# Altium schematic sheet power2pix_connector.SchDoc
size A4
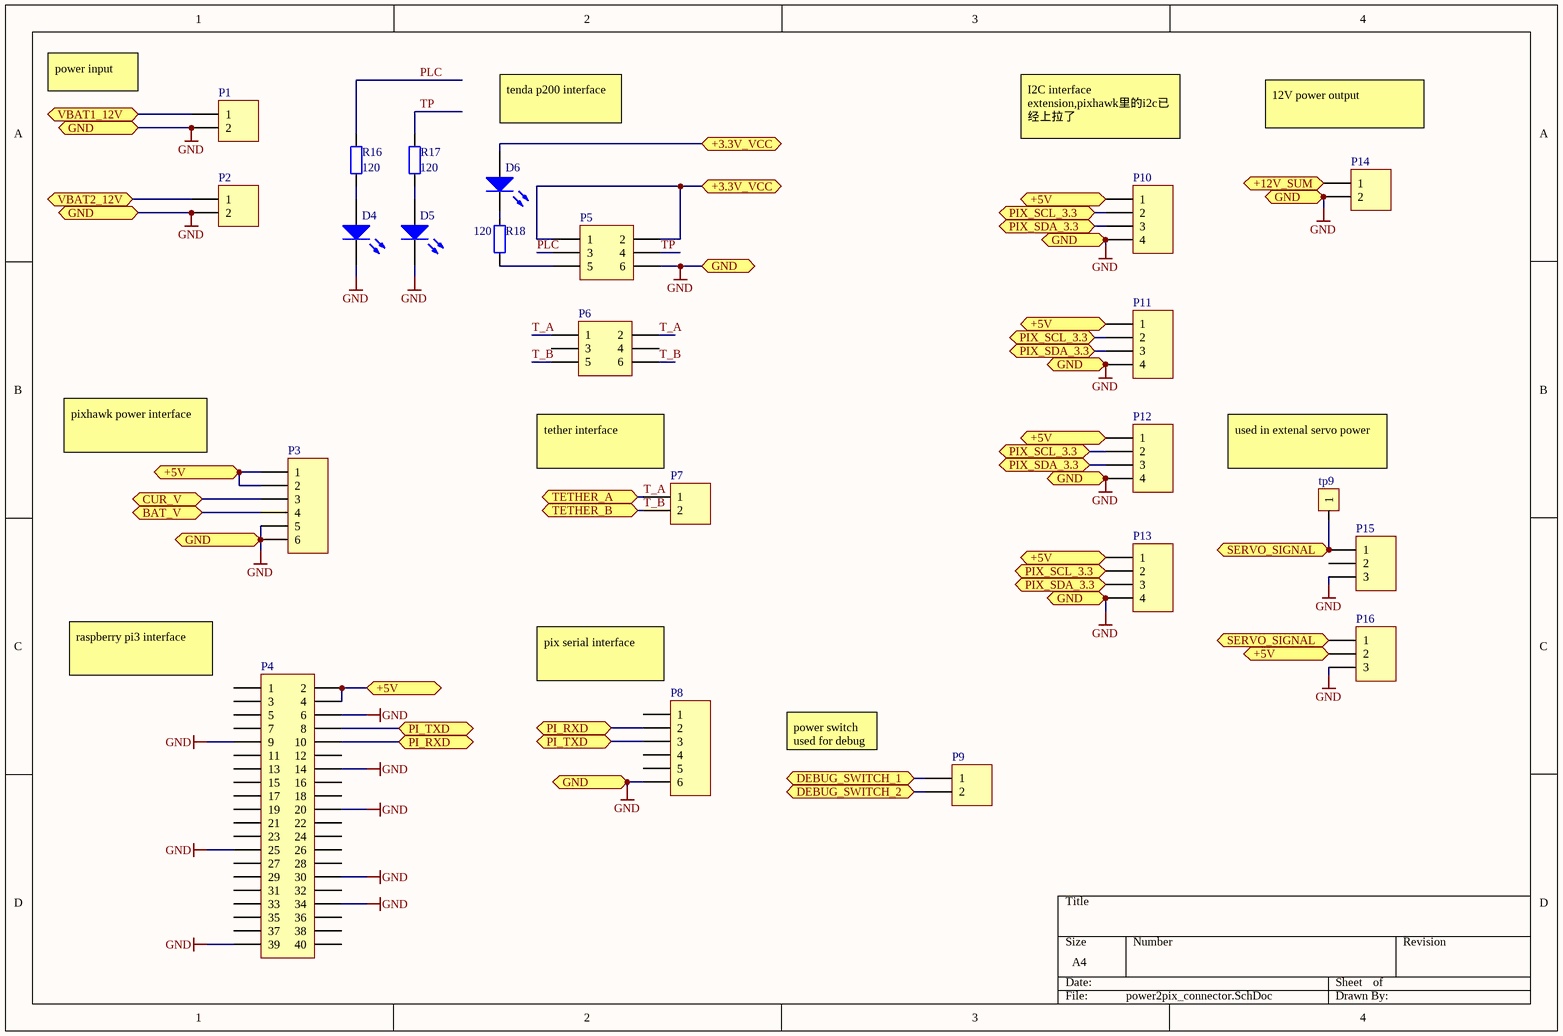
[diagram p0: power2pix_connector.SchDoc]

## Parts
D4  LED0  [6-0805_M]  (value not drawn)
D5  LED0  [6-0805_M]  (value not drawn)
D6  LED0  [6-0805_M]  (value not drawn)
P1  Header 2  [M4_POWER]  (value not drawn)
P2  Header 2  [M4_POWER]  (value not drawn)
P3  Header 6  [1.25_6PIN]  (value not drawn)
P4  Header 20X2  [HDR2X20]  (value not drawn)
P5  Header 3X2  [HDR2X3]  (value not drawn)
P6  Header 3X2  [HDR2X3]  (value not drawn)
P7  Header 2  [ConnectorBlue]  (value not drawn)
P8  Header 6  [1.25_6PIN]  (value not drawn)
P9  Header 2  [HDR1X2]  (value not drawn)
P10  Header 4  [1_25_4PIN]  (value not drawn)
P11  Header 4  [HDR1X4]  (value not drawn)
P12  Header 4  [HDR1X4]  (value not drawn)
P13  Header 4  [HDR1X4]  (value not drawn)
P14  Header 2  [M4_POWER]  (value not drawn)
P15  Header 3  [HDR1X3]  (value not drawn)
P16  Header 3  [HDR1X3]  (value not drawn)
R16  value 120  [6-0805_M]  (hidden comment: Res2)
R17  value 120  [6-0805_M]  (hidden comment: Res2)
R18  value 120  [6-0805_M]  (hidden comment: Res2)
tp9  tp  [testpoint]  (value not drawn)

## Ports
+3.3V_VCC, +5V, +12V_SUM, BAT_V, CUR_V, DEBUG_SWITCH_1, DEBUG_SWITCH_2, GND, PI_RXD, PI_TXD, PIX_SCL_3.3, PIX_SDA_3.3, SERVO_SIGNAL, TETHER_A, TETHER_B, VBAT1_12V, VBAT2_12V

## Nets
GND: D4.2(K) D5.2(K) P1.2 P2.2 P3.5 P3.6 P4.6 P4.9 P4.14 P4.20 P4.25 P4.30 P4.34 P4.39 P5.6 P8.6 P10.4 P11.4 P12.4 P13.4 P14.2 P15.3 P16.3 ; port GND
+3.3V_VCC: D6.1(A) P5.1 P5.2 ; port +3.3V_VCC
+5V: P3.1 P3.2 P4.2 P4.4 P10.1 P11.1 P12.1 P13.1 P16.2 ; port +5V
+12V_SUM: P14.1 ; port +12V_SUM
BAT_V: P3.4 ; port BAT_V
CUR_V: P3.3 ; port CUR_V
DEBUG_SWITCH_1: P9.1 ; port DEBUG_SWITCH_1
DEBUG_SWITCH_2: P9.2 ; port DEBUG_SWITCH_2
PI_RXD: P4.10 P8.2 ; port PI_RXD
PI_TXD: P4.8 P8.3 ; port PI_TXD
PIX_SCL_3.3: P10.2 P11.2 P12.2 P13.2 ; port PIX_SCL_3.3
PIX_SDA_3.3: P10.3 P11.3 P12.3 P13.3 ; port PIX_SDA_3.3
PLC: P5.3 R16.2
SERVO_SIGNAL: P15.1 P16.1 tp9.1 ; port SERVO_SIGNAL
T_A: P6.1 P6.2 P7.1 ; port TETHER_A
T_B: P6.5 P6.6 P7.2 ; port TETHER_B
TP: P5.4 R17.2
VBAT1_12V: P1.1 ; port VBAT1_12V
VBAT2_12V: P2.1 ; port VBAT2_12V
NetD4_1: D4.1(A) R16.1
NetD5_1: D5.1(A) R17.1
NetD6_2: D6.2(K) R18.2
NetP5_5: P5.5 R18.1

Not connected (* = marked no-connect by the designer): P4 1 3 5 7 11 12 13 15 16 17 18 19 21 22 23 24 26 27 28 29 31 32 33 35 36 37 38 40; P6 3 4; P8 1 4 5; P15 2

## Notes on the sheet
- power input
- tenda p200 interface
- I2C interface extension,pixhawk里的i2c已经上拉了
- 12V power output
- pixhawk power interface
- (near P7) tether interface
- (near tp9) used in extenal servo power
- (near P4) raspberry pi3 interface
- (near P8) pix serial interface
- power switch used for debug

## Library data of the parts
D4-D6 = LED0: Typical INFRARED GaAs LED; Published: 8-Jun-2000; LatestRevisionDate: 08-Jul-2005; LatestRevisionNote: Mech Layer 1 removed.; PackageReference: LED-0; Publisher: Altium Limited; PackageDescription: LED; 2 Leads
P1 P2 P7 P9 P14 = Header 2: Header, 2-Pin; LatestRevisionDate: 17-Jul-2002; LatestRevisionNote: Re-released for DXP Platform.; Publisher: Altium Limited
P3 P8 = Header 6: Header, 6-Pin; LatestRevisionDate: 17-Jul-2002; LatestRevisionNote: Re-released for DXP Platform.; Publisher: Altium Limited
P4 = Header 20X2: Header, 20-Pin, Dual row; LatestRevisionDate: 17-Jul-2002; LatestRevisionNote: Re-released for DXP Platform.; Publisher: Altium Limited
P5 P6 = Header 3X2: Header, 3-Pin, Dual row; LatestRevisionDate: 17-Jul-2002; LatestRevisionNote: Re-released for DXP Platform.; Publisher: Altium Limited
P10-P13 = Header 4: Header, 4-Pin; LatestRevisionDate: 17-Jul-2002; LatestRevisionNote: Re-released for DXP Platform.; Publisher: Altium Limited
P15 P16 = Header 3: Header, 3-Pin; LatestRevisionDate: 17-Jul-2002; LatestRevisionNote: Re-released for DXP Platform.; Publisher: Altium Limited
R16-R18 = Res2: Resistor; Published: 8-Jun-2000; LatestRevisionDate: 17-Jul-2002; LatestRevisionNote: Re-released for DXP Platform.; PackageReference: AXIAL-0.4; Publisher: Altium Limited; PackageDescription: Axial Device, Thru-Hole; 2 Leads; 0.4 in Pin Spacing